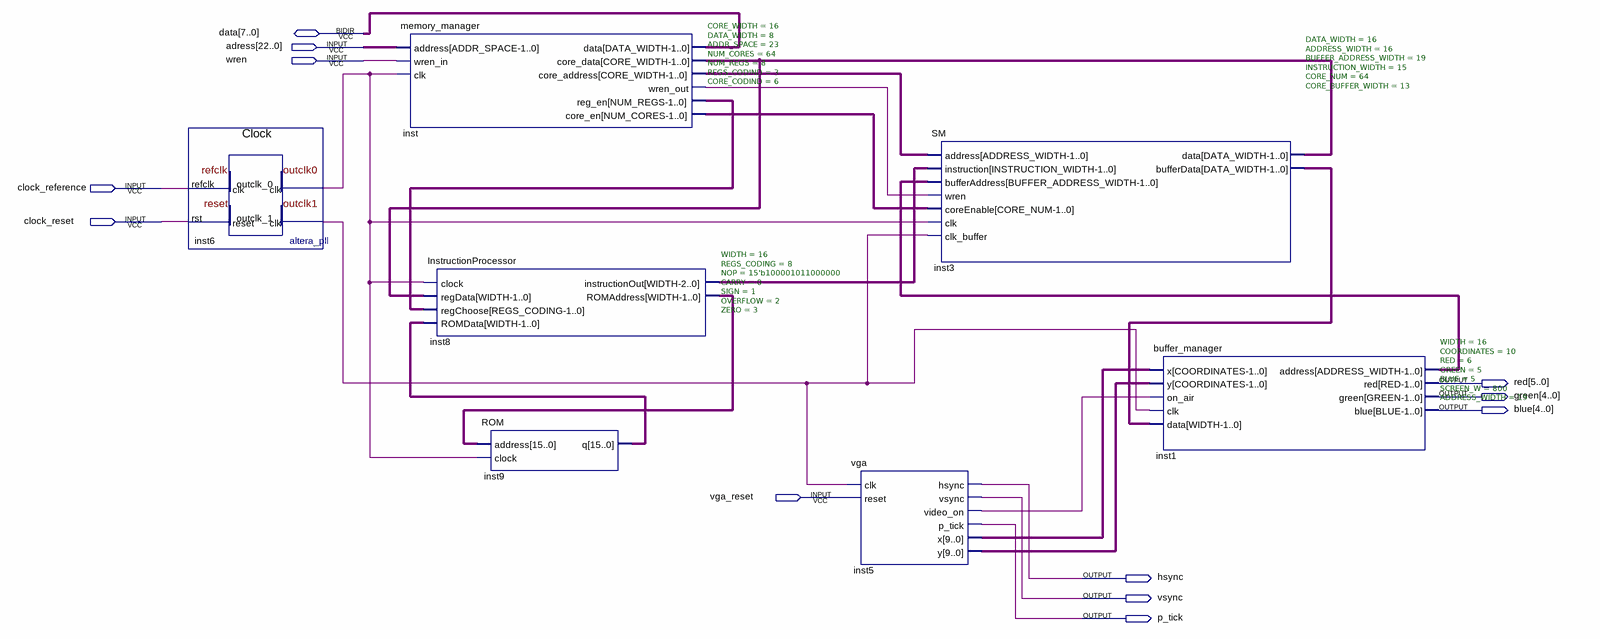
[diagram p0: schematic sheet]
// Quartus schematic Components.bdf as structural Verilog: 7 symbols, 12 pins
module Components (
  input  [22:0] adress,
  input  wren,
  input  clock_reference,
  input  clock_reset,
  input  vga_reset,
  inout  [7:0] data,
  output [5:0] red,
  output [4:0] green,
  output [4:0] blue,
  output hsync,
  output vsync,
  output p_tick
);

  wire inst5_video_on, inst6_outclk_0, inst6_outclk_1, inst_wren_out;
  wire [7:0] inst_reg_en;
  wire [9:0] inst5_x, inst5_y;
  wire [14:0] inst8_instructionout;
  wire [15:0] inst3_bufferdata, inst8_romaddress, inst9_q, inst_core_address, inst_core_data;
  wire [18:0] inst1_address;
  wire [63:0] inst_core_en;

  Clock inst6 (.refclk(clock_reference), .rst(clock_reset), .outclk_0(inst6_outclk_0), .outclk_1(inst6_outclk_1));
  memory_manager #(.CORE_WIDTH(16), .DATA_WIDTH(8), .ADDR_SPACE(23), .NUM_CORES(64), .NUM_REGS(8), .REGS_CODIND(3), .CORE_CODIND(6)) inst (
    .address(adress), .wren_in(wren), .clk(inst6_outclk_0), .core_address(inst_core_address),
    .wren_out(inst_wren_out), .reg_en(inst_reg_en), .core_en(inst_core_en), .data(data),
    .core_data(inst_core_data));
  InstructionProcessor #(.WIDTH(16), .REGS_CODING(8), .NOP(15'b100001011000000), .CARRY(0), .SIGN(1), .OVERFLOW(2), .ZERO(3)) inst8 (
    .clock(inst6_outclk_0), .regData(inst_core_data), .regChoose(inst_reg_en), .ROMData(inst9_q),
    .instructionOut(inst8_instructionout), .ROMAddress(inst8_romaddress));
  ROM inst9 (.address(inst8_romaddress), .clock(inst6_outclk_0), .q(inst9_q));
  vga inst5 (
    .clk(inst6_outclk_1), .reset(vga_reset), .hsync(hsync), .vsync(vsync), .video_on(inst5_video_on),
    .p_tick(p_tick), .x(inst5_x), .y(inst5_y));
  SM #(.DATA_WIDTH(16), .ADDRESS_WIDTH(16), .BUFFER_ADDRESS_WIDTH(19), .INSTRUCTION_WIDTH(15), .CORE_NUM(64), .CORE_BUFFER_WIDTH(13)) inst3 (
    .address(inst_core_address), .instruction(inst8_instructionout), .bufferAddress(inst1_address),
    .wren(inst_wren_out), .coreEnable(inst_core_en), .clk(inst6_outclk_0), .clk_buffer(inst6_outclk_1),
    .bufferData(inst3_bufferdata), .data(inst_core_data));
  buffer_manager #(.WIDTH(16), .COORDINATES(10), .RED(6), .GREEN(5), .BLUE(5), .SCREEN_W(800), .ADDRESS_WIDTH(19)) inst1 (
    .x(inst5_x), .y(inst5_y), .on_air(inst5_video_on), .clk(inst6_outclk_1), .data(inst3_bufferdata),
    .address(inst1_address), .red(red), .green(green), .blue(blue));
endmodule
